# EAGLE design CalcSchematic (EAGLE 9.7.0)
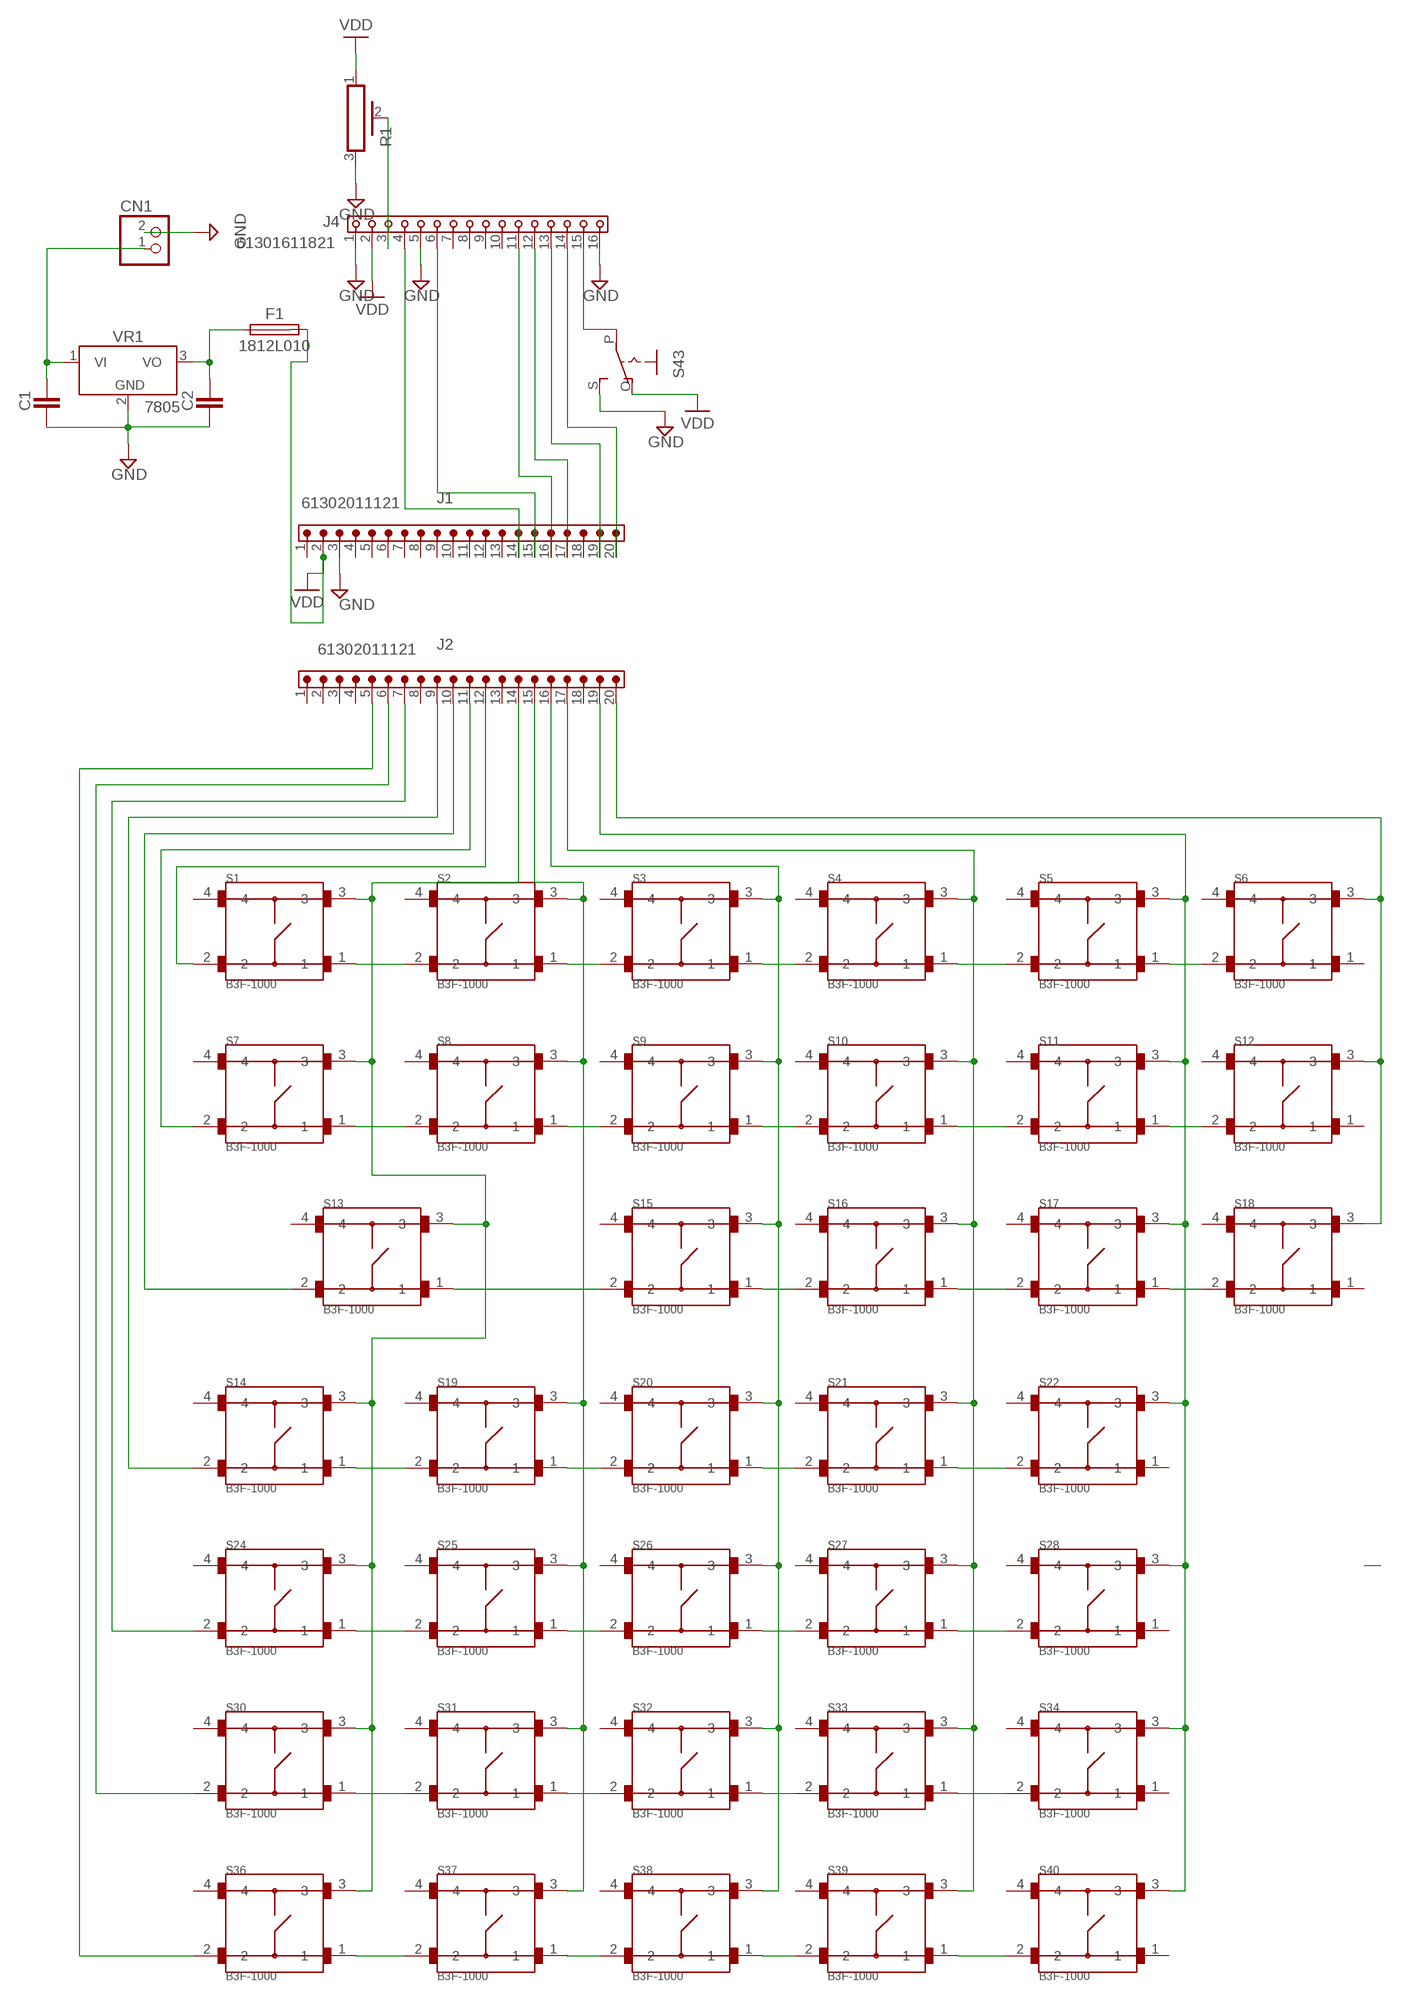
[diagram p0: schematic, sheet 1]

## Parts
C1  CAPACITOR_CHIP-1206(3216-METRIC)  [CAPC3216X135]
C2  CAPACITOR_CHIP-1206(3216-METRIC)  [CAPC3216X135]
CN1  JST_2PIN-THM  [JST-PH-2-THM]
F1  1812L010  [FUSC4532X125]
J1  61302011121  6130XX11121_61302011121  [61302011121]
J2  61302011121  6130XX11121_61302011121  [61302011121]
J4  61301611821  6130XX11821_61301611821  [61301611821]
R1  POT_PV36P  [PV36P]
S1  B3F-1000  [SW_B3F-1000]
S2  B3F-1000  [SW_B3F-1000]
S3  B3F-1000  [SW_B3F-1000]
S4  B3F-1000  [SW_B3F-1000]
S5  B3F-1000  [SW_B3F-1000]
S6  B3F-1000  [SW_B3F-1000]
S7  B3F-1000  [SW_B3F-1000]
S8  B3F-1000  [SW_B3F-1000]
S9  B3F-1000  [SW_B3F-1000]
S10  B3F-1000  [SW_B3F-1000]
S11  B3F-1000  [SW_B3F-1000]
S12  B3F-1000  [SW_B3F-1000]
S13  B3F-1000  [SW_B3F-1000]
S14  B3F-1000  [SW_B3F-1000]
S15  B3F-1000  [SW_B3F-1000]
S16  B3F-1000  [SW_B3F-1000]
S17  B3F-1000  [SW_B3F-1000]
S18  B3F-1000  [SW_B3F-1000]
S19  B3F-1000  [SW_B3F-1000]
S20  B3F-1000  [SW_B3F-1000]
S21  B3F-1000  [SW_B3F-1000]
S22  B3F-1000  [SW_B3F-1000]
S24  B3F-1000  [SW_B3F-1000]
S25  B3F-1000  [SW_B3F-1000]
S26  B3F-1000  [SW_B3F-1000]
S27  B3F-1000  [SW_B3F-1000]
S28  B3F-1000  [SW_B3F-1000]
S30  B3F-1000  [SW_B3F-1000]
S31  B3F-1000  [SW_B3F-1000]
S32  B3F-1000  [SW_B3F-1000]
S33  B3F-1000  [SW_B3F-1000]
S34  B3F-1000  [SW_B3F-1000]
S36  B3F-1000  [SW_B3F-1000]
S37  B3F-1000  [SW_B3F-1000]
S38  B3F-1000  [SW_B3F-1000]
S39  B3F-1000  [SW_B3F-1000]
S40  B3F-1000  [SW_B3F-1000]
S43  EG1218S  [EG1218]
VR1  7805  LM7805_TO220V  [TO220V]

## Nets
GND: C1.2 C2.2 CN1.2 J1.3 J4.1 J4.5 J4.16 R1.3 S43.S VR1.2(GND)
N$1: S1.1 S2.2
N$2: S2.1 S3.2
N$3: S3.1 S4.2
N$4: S4.1 S5.2
N$5: S5.1 S6.2
N$6: S7.1 S8.2
N$7: S8.1 S9.2
N$8: S9.1 S10.2
N$9: S10.1 S11.2
N$10: S11.1 S12.2
N$11: S13.1 S15.2
N$12: S15.1 S16.2
N$13: S16.1 S17.2
N$14: S17.1 S18.2
N$15: S14.1 S19.2
N$16: S19.1 S20.2
N$17: S20.1 S21.2
N$18: S21.1 S22.2
N$20: S24.1 S25.2
N$21: S25.1 S26.2
N$22: S26.1 S27.2
N$23: S27.1 S28.2
N$24: C2.1 F1.1 VR1.3(VO)
N$25: S30.1 S31.2
N$26: S31.1 S32.2
N$27: S32.1 S33.2
N$28: S33.1 S34.2
N$30: S36.1 S37.2
N$31: S37.1 S38.2
N$32: S38.1 S39.2
N$33: S39.1 S40.2
N$35: J2.14 S1.3 S7.3 S13.3 S14.3 S24.3 S30.3 S36.3
N$36: J2.15 S2.3 S8.3 S19.3 S25.3 S31.3 S37.3
N$37: J2.16 S3.3 S9.3 S15.3 S20.3 S26.3 S32.3 S38.3
N$38: J2.17 S4.3 S10.3 S16.3 S21.3 S27.3 S33.3 S39.3
N$39: J2.19 S5.3 S11.3 S17.3 S22.3 S28.3 S34.3 S40.3
N$40: J2.20 S6.3 S12.3 S18.3
N$41: J2.12 S1.2
N$42: J2.11 S7.2
N$43: J2.10 S13.2
N$44: J2.9 S14.2
N$45: J2.7 S24.2
N$46: J2.6 S30.2
N$47: J2.5 S36.2
N$48: J4.3 R1.2
N$49: J1.14 J4.4
N$50: J1.15 J4.6
N$51: J1.16 J4.11
N$52: J1.17 J4.12
N$53: J1.19 J4.13
N$54: J1.20 J4.14
N$55: J4.15 S43.P
N$59: C1.1 CN1.1 VR1.1(VI)
VDD: F1.2 J1.2 J4.2 R1.1 S43.O
Unconnected: J1.1 J1.4 J1.5 J1.6 J1.7 J1.8 J1.9 J1.10 J1.11 J1.12 J1.13 J1.18 J2.1 J2.2 J2.3 J2.4 J2.8 J2.13 J2.18 J4.7 J4.8 J4.9 J4.10 S1.4 S2.4 S3.4 S4.4 S5.4 S6.1 S6.4 S7.4 S8.4 S9.4 S10.4 S11.4 S12.1 S12.4 S13.4 S14.4 S15.4 S16.4 S17.4 S18.1 S18.4 S19.4 S20.4 S21.4 S22.1 S22.4 S24.4 S25.4 S26.4 S27.4 S28.1 S28.4 S30.4 S31.4 S32.4 S33.4 S34.1 S34.4 S36.4 S37.4 S38.4 S39.4 S40.1 S40.4

## Library data of the parts
C1 C2 = Tinkercad:CAPACITOR: Capacitor - Generic; CATEGORY: Capacitor
CN1 = adafruit:JST_2PIN: JST 2-Pin Connectors of various flavors SMT-RA (S2B-PH-SM4) 4UConnector #17311 SMT (B2B-PH-SM4) THM-RA (S2B-PH) THM (B2B-PH)
F1 = Fuse:1812L: 1812L Series PTC provides surface mount overcurrent protection for applications where resettable protection is desired. Datasheet <https://www.littelfuse.com/~/media/electronics/datasheets/resettable_ptcs/littelfuse_ptc_1812l_datasheet.pdf.pdf>; CATEGORY: FUSE; DESCRIPTION: Resettable PTCs; MANUFACTURER: Littlefuse; MPN: 1812L010; OPERATING_TEMPERATURE: -40°C to +85°C; PART_STATUS: ACTIVE; ROHS_COMPLIANCE: RoHS Compliant; SERIES: 1812L; SUBCATEGORY: Resettable; TYPE: PTC
J1 J2 = Wurth_Connectors_WR-PHD:6130XX11121_61302011121: WR-PHD 2.54 mm THT Pin Header ARTICLE PROPERTIES: Pins:1;​ 2;​ 3;​ 4;​ 5;​ 6;​ 7;​ 8;​ 9;​ 10;​ 12;​ 13;​ 14;​ 15;​ 16;​ 18;​ 20;​ 22;​ 24;​ 25;​ 32;​ 36;​ 40 KIND PROPERTIES: Pitch：2.54 mm Quality Class:3 as per CECC 75 301-802 Rows：Single Gender：Pin Header Type：Straight MATERIAL PROPERTIES: Insulator Material PA6T; PBT Insulator Flammability Rating:UL94 V-0 Contact Material:Copper Alloy Contact Plating:Gold Contact Type:Stamped GENERAL INFORMATION Operating Temperature:-40 up to +105 °C ELECTRICAL PROPERTIES: Withstanding Voltage 500 V (AC) Contact Resistance 20 mΩ RISO 1000 MΩ CERTIFICATION UL Approval:E323964 PACKAGING PROPERTIES Packaging:Bag <https://www.we-online.com/catalog/media/o33211v209%20Family_BTB_PHD_6130xx11121.jpg> Details see: https://www.we-online.com/katalog/en/em/PHD_2_54_THT_PIN_HEADER_6130XX11121 Updated by Ella Wu 2021-12-08 2021 (C) Würth Elektronik; DATASHEET-URL: https://www.we-online.com/redexpert/spec/61302011121?ae; GENDER: Pin Header; IR: 3A; MOUNT: THT; PACKAGING: Bag; PART-NUMBER: 61302011121; PINS: 20; PITCH: 2.54mm; ROWS: Single; TYPE: Straight
J4 = Wurth_Connectors_WR-PHD:6130XX11821_61301611821: WR-PHD 2.54 mm Socket Header Article Properties Pins (Value) 2 pcs; 3 pcs; 4 pcs; 5 pcs; 6 pcs; 7 pcs; 8 pcs; 9 pcs; 10 pcs; 12 pcs; 13 pcs; 14 pcs; 15 pcs; 16 pcs; 18 pcs; 20 pcs; 22 pcs; 24 pcs; 32 pcs; 36 pcs; 40 pcs General Information Operating Temperature -40 °C up to +105 °C Pitch 2.54 mm Durability 30 Mating cycles; 500 Mating cycles Rows Single Gender Socket Header Type Straight Material Properties Insulator Material PBT Insulator Flammability Rating UL94 V-0 Contact Material Copper Alloy Contact Plating Gold Contact Type Stamped Certification UL Approval E323964 Packaging Properties Packaging Tray Electrical Properties Withstanding Voltage 500 V (AC) Contact Resistance 20 mΩ RISO 1000 MΩ <https://www.we-online.com/components/media/o33218v209%20Family-WR-PHD-6130xx11821.jpg> Details see: www.we-online.com/en/components/products/PHD_2_54_SOCKET_HEADER_6130XX11821 <www.we-online.com/catalog/PHD_2_54_SOCKET_HEADER_6130XX11821/?utm_source=eagle_model&utm_medium=description_link&utm_campaign=eisos_eagle> Updated by Ella 2024-09-11 2024 (C) Würth Elektronik; DATASHEET-URL: https://www.we-online.com/redexpert/spec/61301611821?ae; GENDER: Socket Header; IR: 3A; MOUNT: THT; PACKAGING: Tray; PART-NUMBER: 61301611821; PINS: 16; PITCH: 2.54mm; ROWS: Single; TYPE: Straight
R1 = Tinkercad:POT: Rectangular Trimmer Potentiometers - PV36 Series Datasheet <https://www.bourns.com/docs/Product-Datasheets/pv36.pdf>; CATEGORY: Resistor; DESCRIPTION: Lead Sealed Type Multiturn PV36 Series; MANUFACTURER: BOURNS; MPN: PV36P; OPERATING_TEMPERATURE: -55 to +125 °C; PART_STATUS: Active; ROHS_COMPLIANCE: RoHS Compliant; SERIES: PV36; SUB-CATEGORY: Trimpot; TYPE: Lead Sealed
S1-S22 S24-S28 S30-S34 S36-S40 = B3F-1000:B3F-1000: Check availability <https://pricing.snapeda.com/parts/B3F-1000/Omron/view-part?ref=eda>; AVAILABILITY: In Stock; CHECK_PRICES: https://www.snapeda.com/parts/B3F-1000/Omron/view-part/?ref=eda; DESCRIPTION: Tactile Switch SPST-NO Top Actuated Through Hole; MF: Omron; MP: B3F-1000; PACKAGE: None; PRICE: None; SNAPEDA_LINK: https://www.snapeda.com/parts/B3F-1000/Omron/view-part/?ref=snap
S43 = adafruit:EG1218: SLIDING SWITCH 0.1" spacing through hole, vertical SPDT slide switch http://www.ladyada.net/library/pcb/eaglelibrary.html
VR1 = IC_Power-Management:LM7805: 5V Voltage Regulator Reference Datasheet <https://www.ti.com/lit/ds/symlink/lm340.pdf>; CATEGORY: IC_Linear; DESCRIPTION: 5V Voltage Regulator; MANUFACTURER: Generic; MPN: Generic; SERIES: LM7805; SUB-CATEGORY: Voltage Regulator; TYPE: 5V

## Board
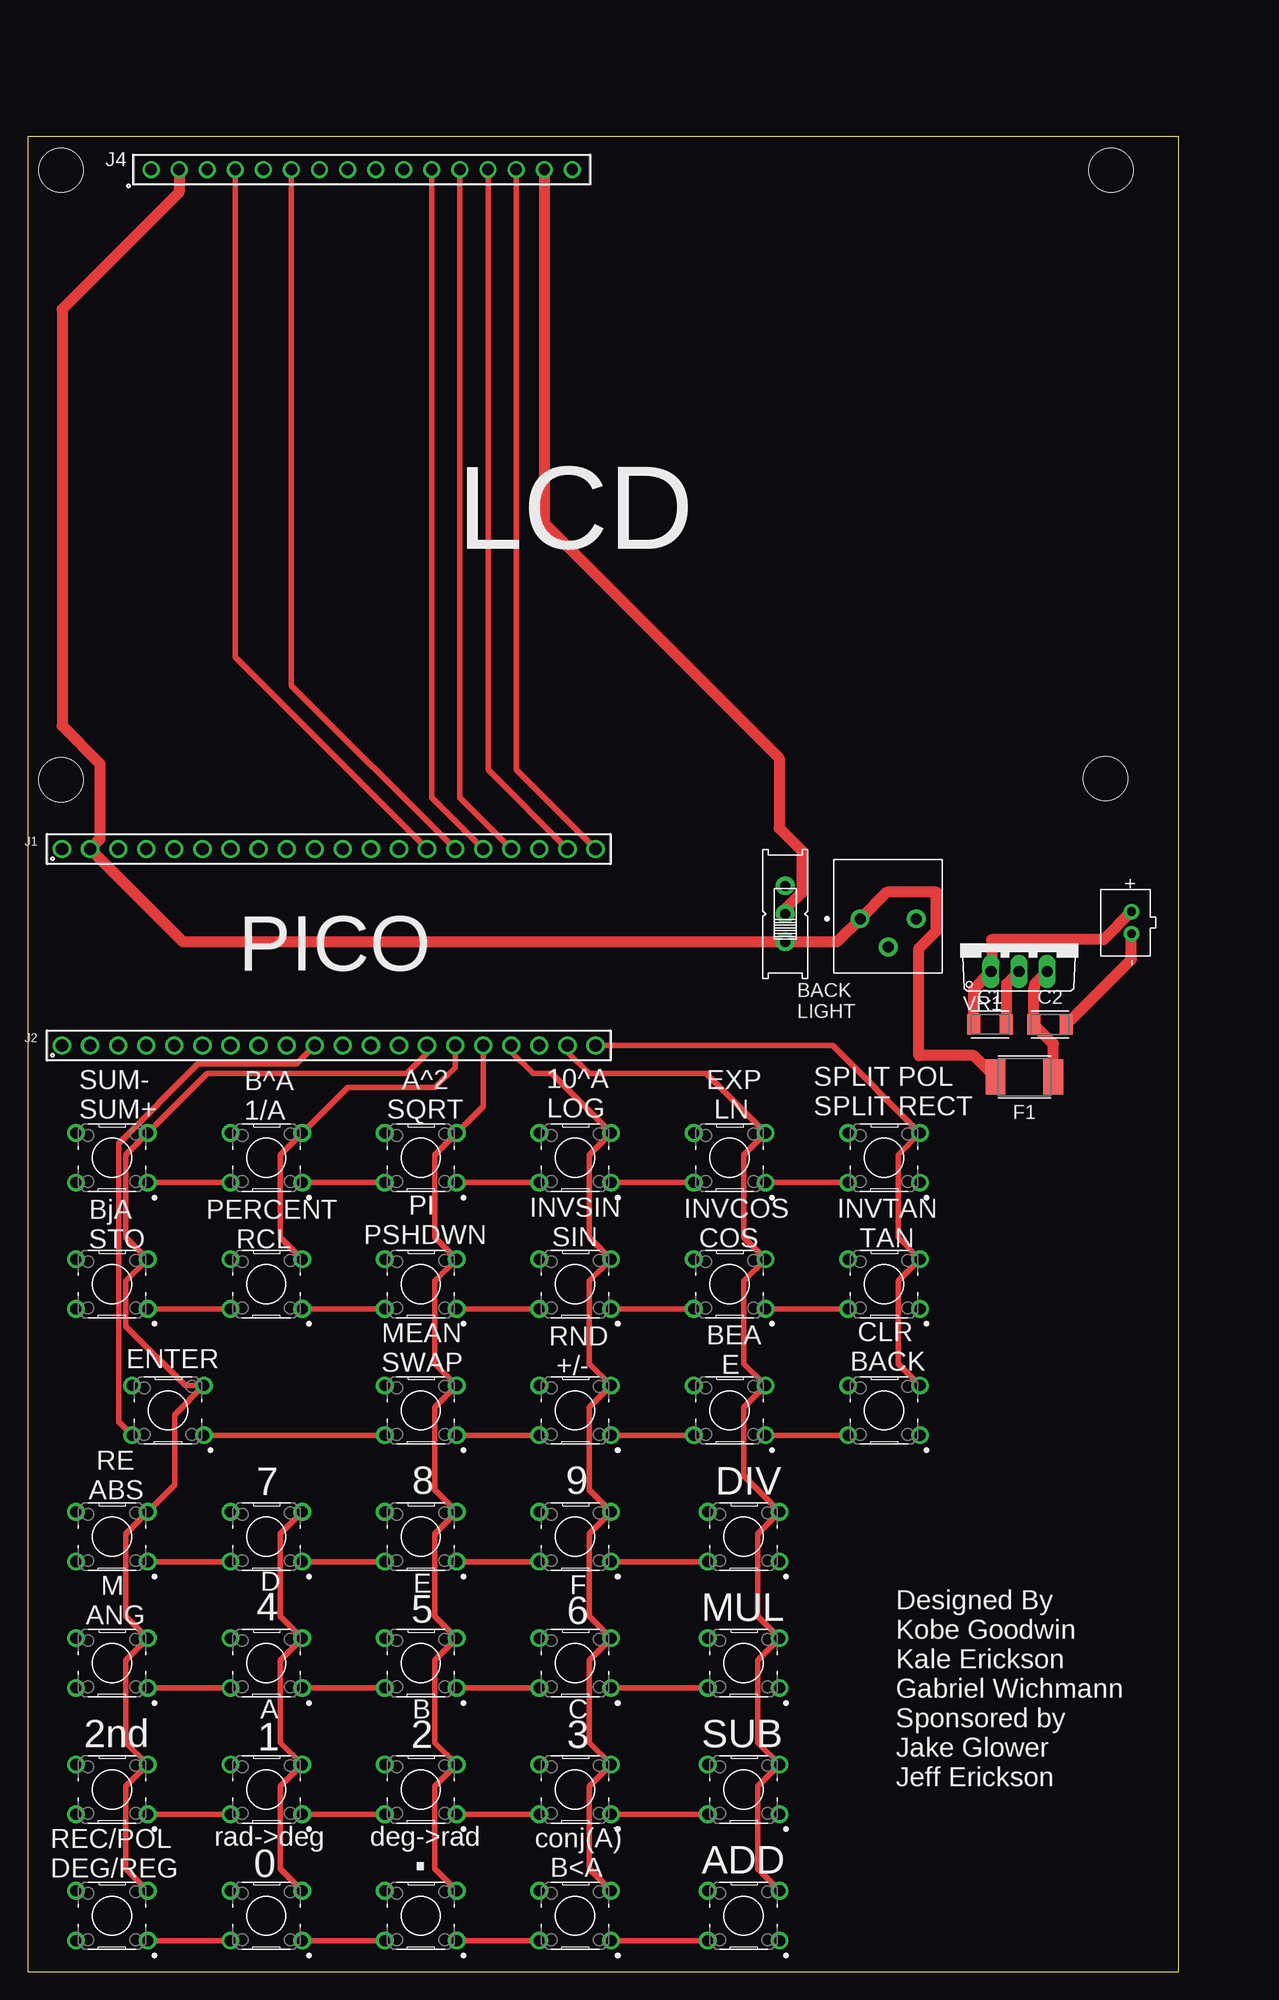
[diagram p1: board, top side]
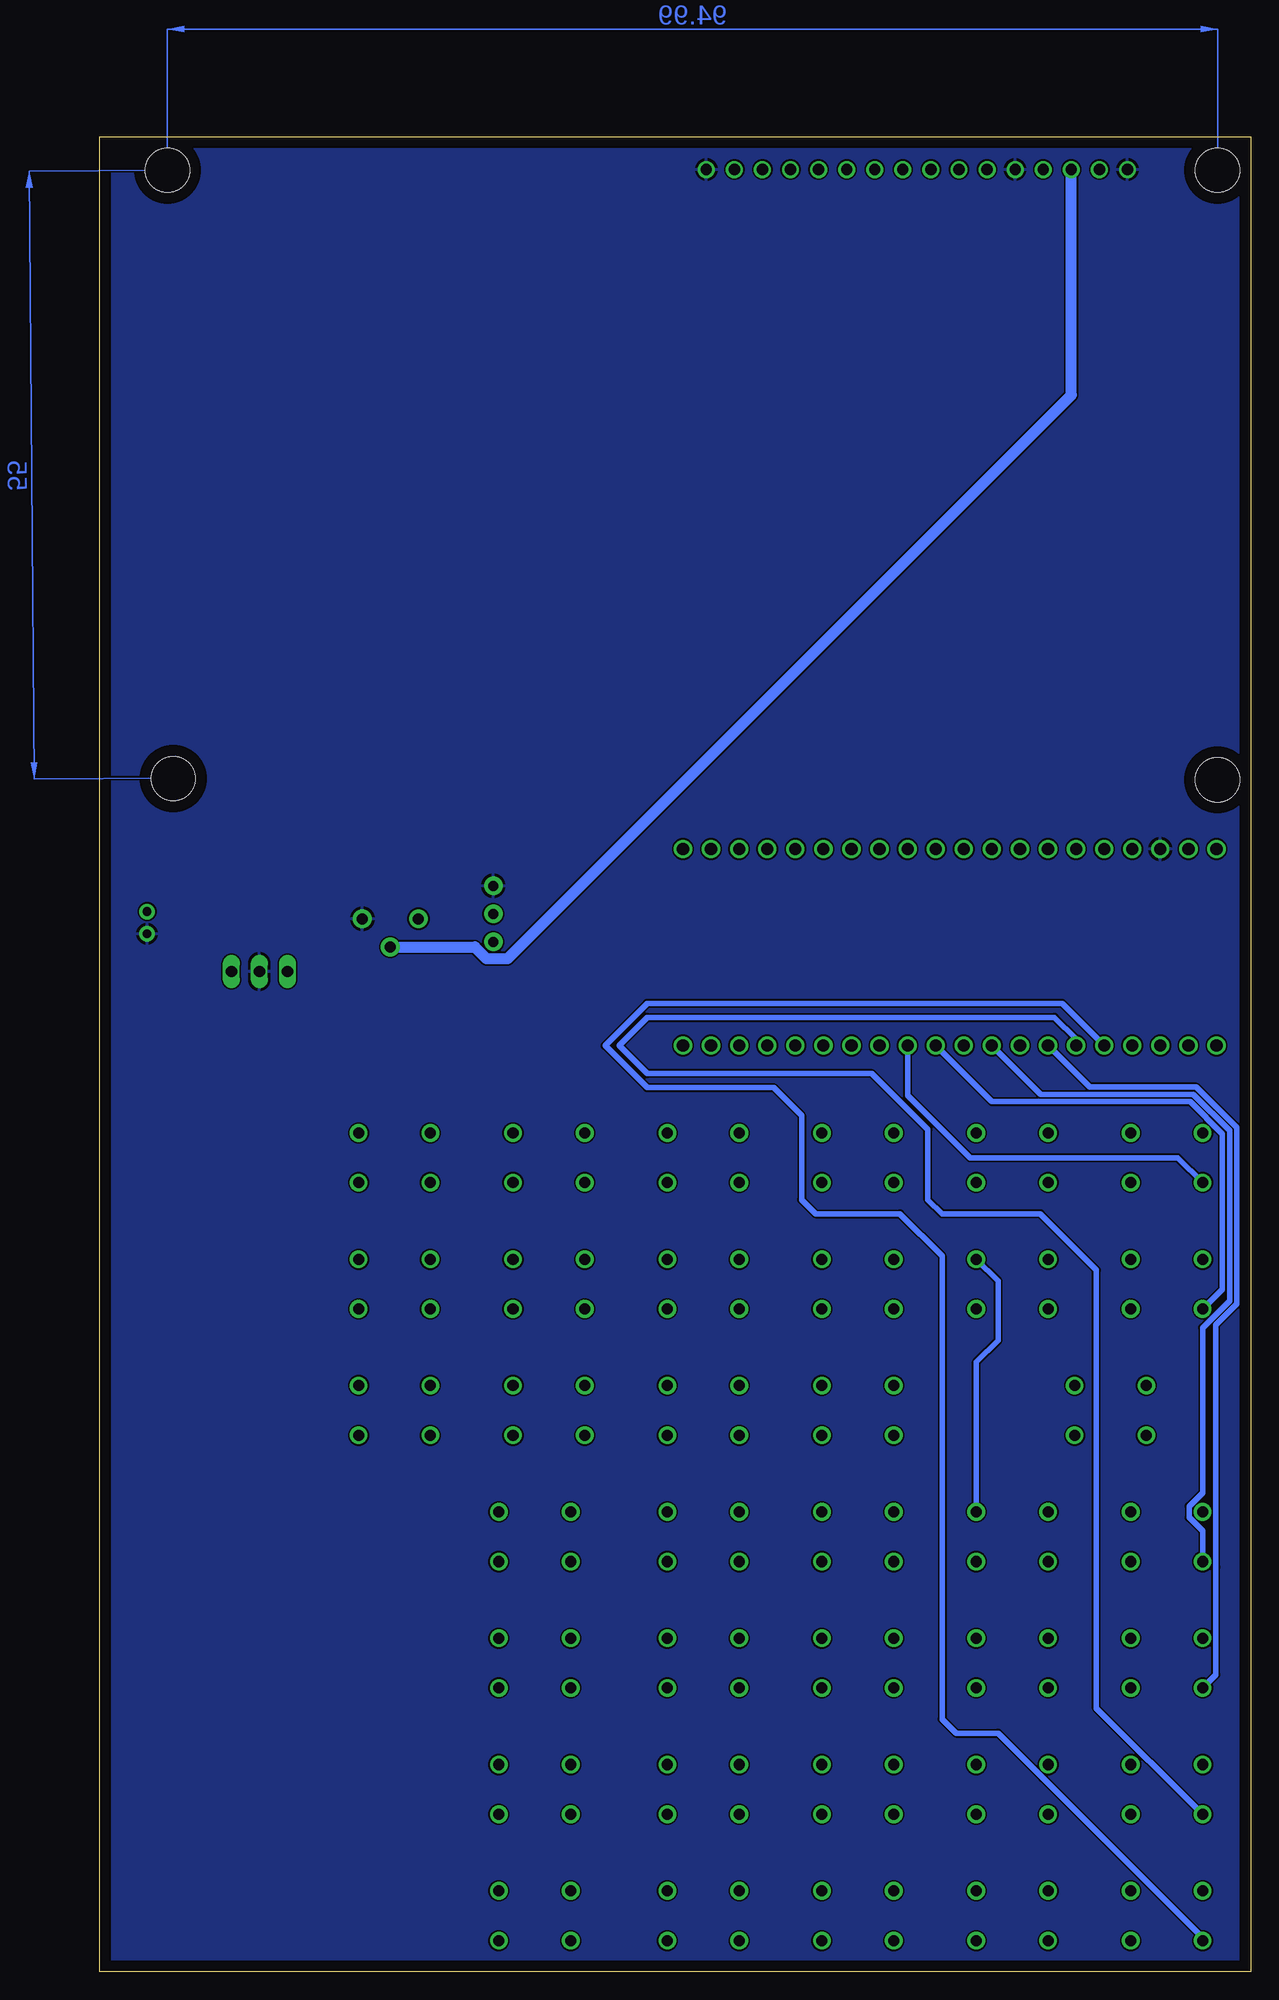
[diagram p2: board, bottom side, seen from below]

Size 104.12 x 166.04 mm. Coordinates in mm from the lower left corner, seen from the top.
Outline: 0,0 104.12,0 104.12,166.04 0,166.04 0,0
Copper layers (1*16): Top 0.035mm / dielectric 1.5mm / Bottom 0.035mm
Design rules "Fusion Electronics Design Rules": minimum track width 6mil, minimum drill 0.35mm, track to track 6mil, track to pad 6mil, pad to pad 6mil, via to via 6mil, smd to smd 6mil, copper to edge 40mil, drill to drill 6mil, minimum pad ring 10mil, minimum via ring 8mil, stop-mask expansion 4mil, vias tented up to drill 0mil, thermal gap 10mil
Holes 4 mm at 3.02,163.02 98,163.02 97.49,107.98 3.02,107.86

### Footprints (pad centres in the part's own frame; a part is rotated, then mirrored left to right if it is on the bottom)
CAPC3216X135 = smd 1.165 x 1.815: 1 -1.475,0; 2 1.475,0
JST-PH-2-THM = drill 0.8 pad 1.422: 1 1,0; 2 -1,0
FUSC4532X125 = smd 1.78 x 3.15: 1 -2.615,0; 2 2.615,0
61302011121 = drill 1.1: 1 -24.13,0; 2 -21.59,0; 3 -19.05,0; 4 -16.51,0; 5 -13.97,0; 6 -11.43,0; 7 -8.89,0; 8 -6.35,0; 9 -3.81,0; 10 -1.27,0; 11 1.27,0; 12 3.81,0; 13 6.35,0; 14 8.89,0; 15 11.43,0; 16 13.97,0; 17 16.51,0; 18 19.05,0; 19 21.59,0; 20 24.13,0
61301611821 = drill 1.02: 1 -19.05,0; 2 -16.51,0; 3 -13.97,0; 4 -11.43,0; 5 -8.89,0; 6 -6.35,0; 7 -3.81,0; 8 -1.27,0; 9 1.27,0; 10 3.81,0; 11 6.35,0; 12 8.89,0; 13 11.43,0; 14 13.97,0; 15 16.51,0; 16 19.05,0
PV36P = drill 1 pad 1.7: 1 0,0; 2 2.54,-2.54; 3 5.08,0
SW_B3F-1000 = drill 1 pad 1.6: 1 -3.25,2.25; 2 3.25,2.25; 3 -3.25,-2.25; 4 3.25,-2.25
EG1218 = drill 0.9 pad 1.676: O -2.54,0; P 0,0; S 2.54,0
TO220V = drill 1.016 long: 1 -2.54,-2.54; 2 0,-2.54; 3 2.54,-2.54

### Placement (x,y rotation side)
C1  87.05,85.74 0 top
C2  92.49,85.73 0 top
CN1  99.85,94.93 90 top
F1  90.17,80.96 180 top
J1  27.24,101.6 0 top
J2  27.24,83.82 0 top
J4  30.21,163.07 0 top
R1  75.3,95.28 0 top
S1  7.62,73.66 180 top
S2  21.59,73.66 180 top
S3  35.56,73.66 180 top
S4  49.53,73.66 180 top
S5  63.5,73.66 180 top
S6  77.47,73.66 180 top
S7  7.62,62.23 180 top
S8  21.59,62.23 180 top
S9  35.56,62.23 180 top
S10  49.53,62.23 180 top
S11  63.5,62.23 180 top
S12  77.47,62.23 180 top
S13  12.7,50.8 180 top
S14  7.62,39.37 180 top
S15  35.56,50.8 180 top
S16  49.53,50.8 180 top
S17  63.5,50.8 180 top
S18  77.47,50.8 180 top
S19  21.59,39.37 180 top
S20  35.56,39.37 180 top
S21  49.53,39.37 180 top
S22  64.77,39.37 180 top
S24  7.62,27.94 180 top
S25  21.59,27.94 180 top
S26  35.56,27.94 180 top
S27  49.53,27.94 180 top
S28  64.77,27.94 180 top
S30  7.62,16.51 180 top
S31  21.59,16.51 180 top
S32  35.56,16.51 180 top
S33  49.53,16.51 180 top
S34  64.77,16.51 180 top
S36  7.62,5.08 180 top
S37  21.59,5.08 180 top
S38  35.56,5.08 180 top
S39  49.53,5.08 180 top
S40  64.77,5.08 180 top
S43  68.53,95.73 90 top
VR1  89.68,93.05 0 top

### Tracks (layer width: path | path; a pad name or v marks a point on that pad's centre or on a via)
GND
  Top 1.016: CN1.2 99.85,91.61 C2.2 | C1.2 88.53,89.12 88.56,89.16 88.56,89.39 VR1.2
  pour Bottom: -32.94,-12.62 130.73,-12.62 130.73,205.66 -32.94,205.66
N$1
  Top 0.508: S1.1 S2.2
N$2
  Top 0.508: S2.1 S3.2
N$3
  Top 0.508: S3.1 S4.2
N$4
  Top 0.508: S4.1 S5.2
N$5
  Top 0.508: S5.1 S6.2
N$6
  Top 0.508: S8.2 S7.1
N$7
  Top 0.508: S9.2 S8.1
N$8
  Top 0.508: S10.2 S9.1
N$9
  Top 0.508: S11.2 S10.1
N$10
  Top 0.508: S12.2 S11.1
N$11
  Top 0.508: S13.1 S15.2
N$12
  Top 0.508: S15.1 S16.2
N$13
  Top 0.508: S17.2 S16.1
N$14
  Top 0.508: S17.1 S18.2
N$15
  Top 0.508: S14.1 S19.2
N$16
  Top 0.508: S20.2 S19.1
N$17
  Top 0.508: S21.2 S20.1
N$18
  Top 0.508: S21.1 S22.2
N$20
  Top 0.508: S24.1 S25.2
N$21
  Top 0.508: S26.2 S25.1
N$22
  Top 0.508: S27.2 S26.1
N$23
  Top 0.508: S28.2 S27.1
N$24
  Top 1.016: 92.33,90.51 VR1.3 91.1,89.39 91.1,89.16 91.01,89.07 C2.1 92.78,83.96 F1.1
N$25
  Top 0.508: S30.1 S31.2
N$26
  Top 0.508: S32.2 S31.1
N$27
  Top 0.508: S32.1 S33.2
N$28
  Top 0.508: S33.1 S34.2
N$30
  Top 0.508: S37.2 S36.1
N$31
  Top 0.508: S38.2 S37.1
N$32
  Top 0.508: S39.2 S38.1
N$33
  Top 0.508: S40.2 S39.1
N$35
  Top 0.508: S36.3 8.89,9.31 8.89,16.78 S30.3 8.89,20.74 8.89,28.21 S24.3 8.89,32.17 8.89,39.64 S14.3 13.31,44.06 13.31,50.41 S13.3 14.26,53.05 8.89,58.42 8.89,62.5 S7.3 8.89,66.46 8.89,73.93 S1.3 16.24,81.28 34.29,81.28 36.13,83.12 J2.14
N$36
  Top 0.508: S37.3 22.86,9.31 22.86,16.78 S31.3 22.86,20.74 22.86,28.21 S25.3 22.86,32.17 22.86,39.64 S19.3 | S8.3 22.86,66.46 22.86,73.93 S2.3 28.94,80.01 36.83,80.01 38.67,81.85 J2.15
  Bottom 0.508: S19.3 24.84,55.17 22.86,57.15 22.86,62.5 S8.3
N$37
  Top 0.508: S38.3 36.83,9.31 36.83,16.78 S32.3 36.83,20.74 36.83,28.21 S26.3 36.83,32.17 36.83,39.64 S20.3 36.83,43.6 36.83,51.07 S15.3 36.83,55.03 36.83,62.5 S9.3 36.83,66.46 36.83,73.93 S3.3 41.21,78.31 J2.16
N$38
  Top 0.508: S39.3 50.8,9.31 50.8,16.78 S33.3 50.8,20.74 50.8,28.21 S27.3 50.8,32.17 50.8,39.64 S21.3 50.8,43.6 50.8,51.07 S16.3 50.8,55.03 50.8,62.5 S10.3 50.8,66.46 50.8,73.93 S4.3 47.41,81.28 45.72,81.28 43.75,83.25 J2.17
N$39
  Top 0.508: S40.3 66.04,9.31 66.04,16.78 S34.3 66.04,20.74 66.04,28.21 S28.3 66.04,32.17 66.04,39.64 S22.3 64.77,44.87 64.77,51.07 S17.3 64.77,55.03 64.77,62.5 S11.3 64.77,66.46 64.77,73.93 S5.3 61.38,81.28 50.8,81.28 48.83,83.25 J2.19
N$40
  Top 0.508: J2.20 72.81,83.82 S6.3 78.74,73.93 78.74,66.46 S12.3 78.74,62.5 78.74,55.03 S18.3
N$41
  Bottom 0.508: S1.2 6.62,73.66 25.4,73.66 31.05,79.31 J2.12
N$42
  Bottom 0.508: J2.11 23.43,78.74 5.49,78.74 2.59,75.84 2.59,61.76 S7.2
N$43
  Top 0.508: S13.2 8.23,49.77 8.23,74.98 15.4,82.14 24.29,82.14 J2.10
N$44
  Bottom 0.508: J2.9 19.01,79.4 5.22,79.4 1.93,76.11 1.93,60.71 4.37,58.27 4.37,43.33 5.58,42.12 5.58,41.12 4.37,39.91 S14.2
N$45
  Bottom 0.508: J2.7 14.59,80.06 4.95,80.06 1.27,76.38 1.27,60.44 3.16,58.55 3.16,36.62 3.16,26.9 S24.2
N$46
  Bottom 0.508: S30.2 13.97,23.86 13.97,63.5 19.05,68.58 27.94,68.58 29.21,69.85 29.21,76.2 34.29,81.28 54.61,81.28 57.15,83.82 54.61,86.36 17.78,86.36 15.81,84.39 J2.6
N$47
  Bottom 0.508: J2.5 17.08,87.63 54.61,87.63 58.42,83.82 54.61,80.01 43.18,80.01 40.64,77.47 40.64,69.85 39.37,68.58 31.75,68.58 27.94,64.77 27.94,22.86 26.67,21.59 22.88,21.59 18.84,17.55 18.82,17.55 4.37,3.1 S36.2
N$48
  Bottom 1.016: J4.3 16.24,142.67 67.22,91.69 69.15,91.69 70.21,92.74 R1.2
N$49
  Top 0.508: J4.4 18.78,118.95 J1.14
N$50
  Top 0.508: J4.6 23.86,116.41 J1.15
N$51
  Top 0.508: J4.11 36.56,106.25 J1.16
N$52
  Top 0.508: J4.12 39.1,106.25 J1.17
N$53
  Top 0.508: J4.13 41.64,108.79 J1.19
N$54
  Top 0.508: J4.14 44.18,108.79 J1.20
N$55
  Top 1.016: J4.15 46.72,131.08 67.98,109.82 67.98,103.49 70.03,101.44 70.03,97.65 68.53,96.15 S43.P
N$59
  Top 1.016: CN1.1 97.32,93.4 87.21,93.4 87.21,90.58 VR1.1 85.58,88.95 C1.1
VDD
  Top 1.016: J4.2 13.7,161.02 3.11,150.43 3.11,112.75 6.54,109.32 6.54,102.49 J1.2 14.06,93.19 S43.O 73.21,93.19 R1.1 77.72,97.7 82.21,97.7 82.21,94.2 80.61,92.6 80.61,82.91 85.6,82.91 F1.2
(copper drawn outside any net)
  shapes: Bottom area x2

### Text on the board
tPlace: LCD | PICO | BACK / LIGHT | SUM- / SUM+ | B^A / 1/A | A^2 / SQRT | 10^A / LOG | EXP / LN | SPLIT POL / SPLIT RECT | PI / PSHDWN | INVSIN / SIN | INVCOS / COS | INVTAN / TAN | BjA / STO | PERCENT / RCL | ENTER | MEAN / SWAP | RND / +/- | BEA / E | CLR / BACK | RE / ABS | 7 | 8 | 9 | DIV | D | E | F | 4 | 5 | MUL | M / ANG | 6 | A | B | C | 2nd | 1 | 2 | 3 | SUB | Designed By / Kobe Goodwin / Kale Erickson / Gabriel Wichmann / Sponsored by / Jake Glower / Jeff Erickson | rad->deg | deg->rad | REC/POL / DEG/REG | 0 | . | conj(A) / B<A | ADD